# Altium schematic sheet Power.SchDoc: Power
size B; Organization: UCLA High Energy Physics; DocumentNumber: 7; Revision: 2.0; SheetNumber: 7; SheetTotal: 23; CurrentDate: 9/6/2018; ModifiedDate: 9/6/2018; Rule: PcbType=ProtelPcb
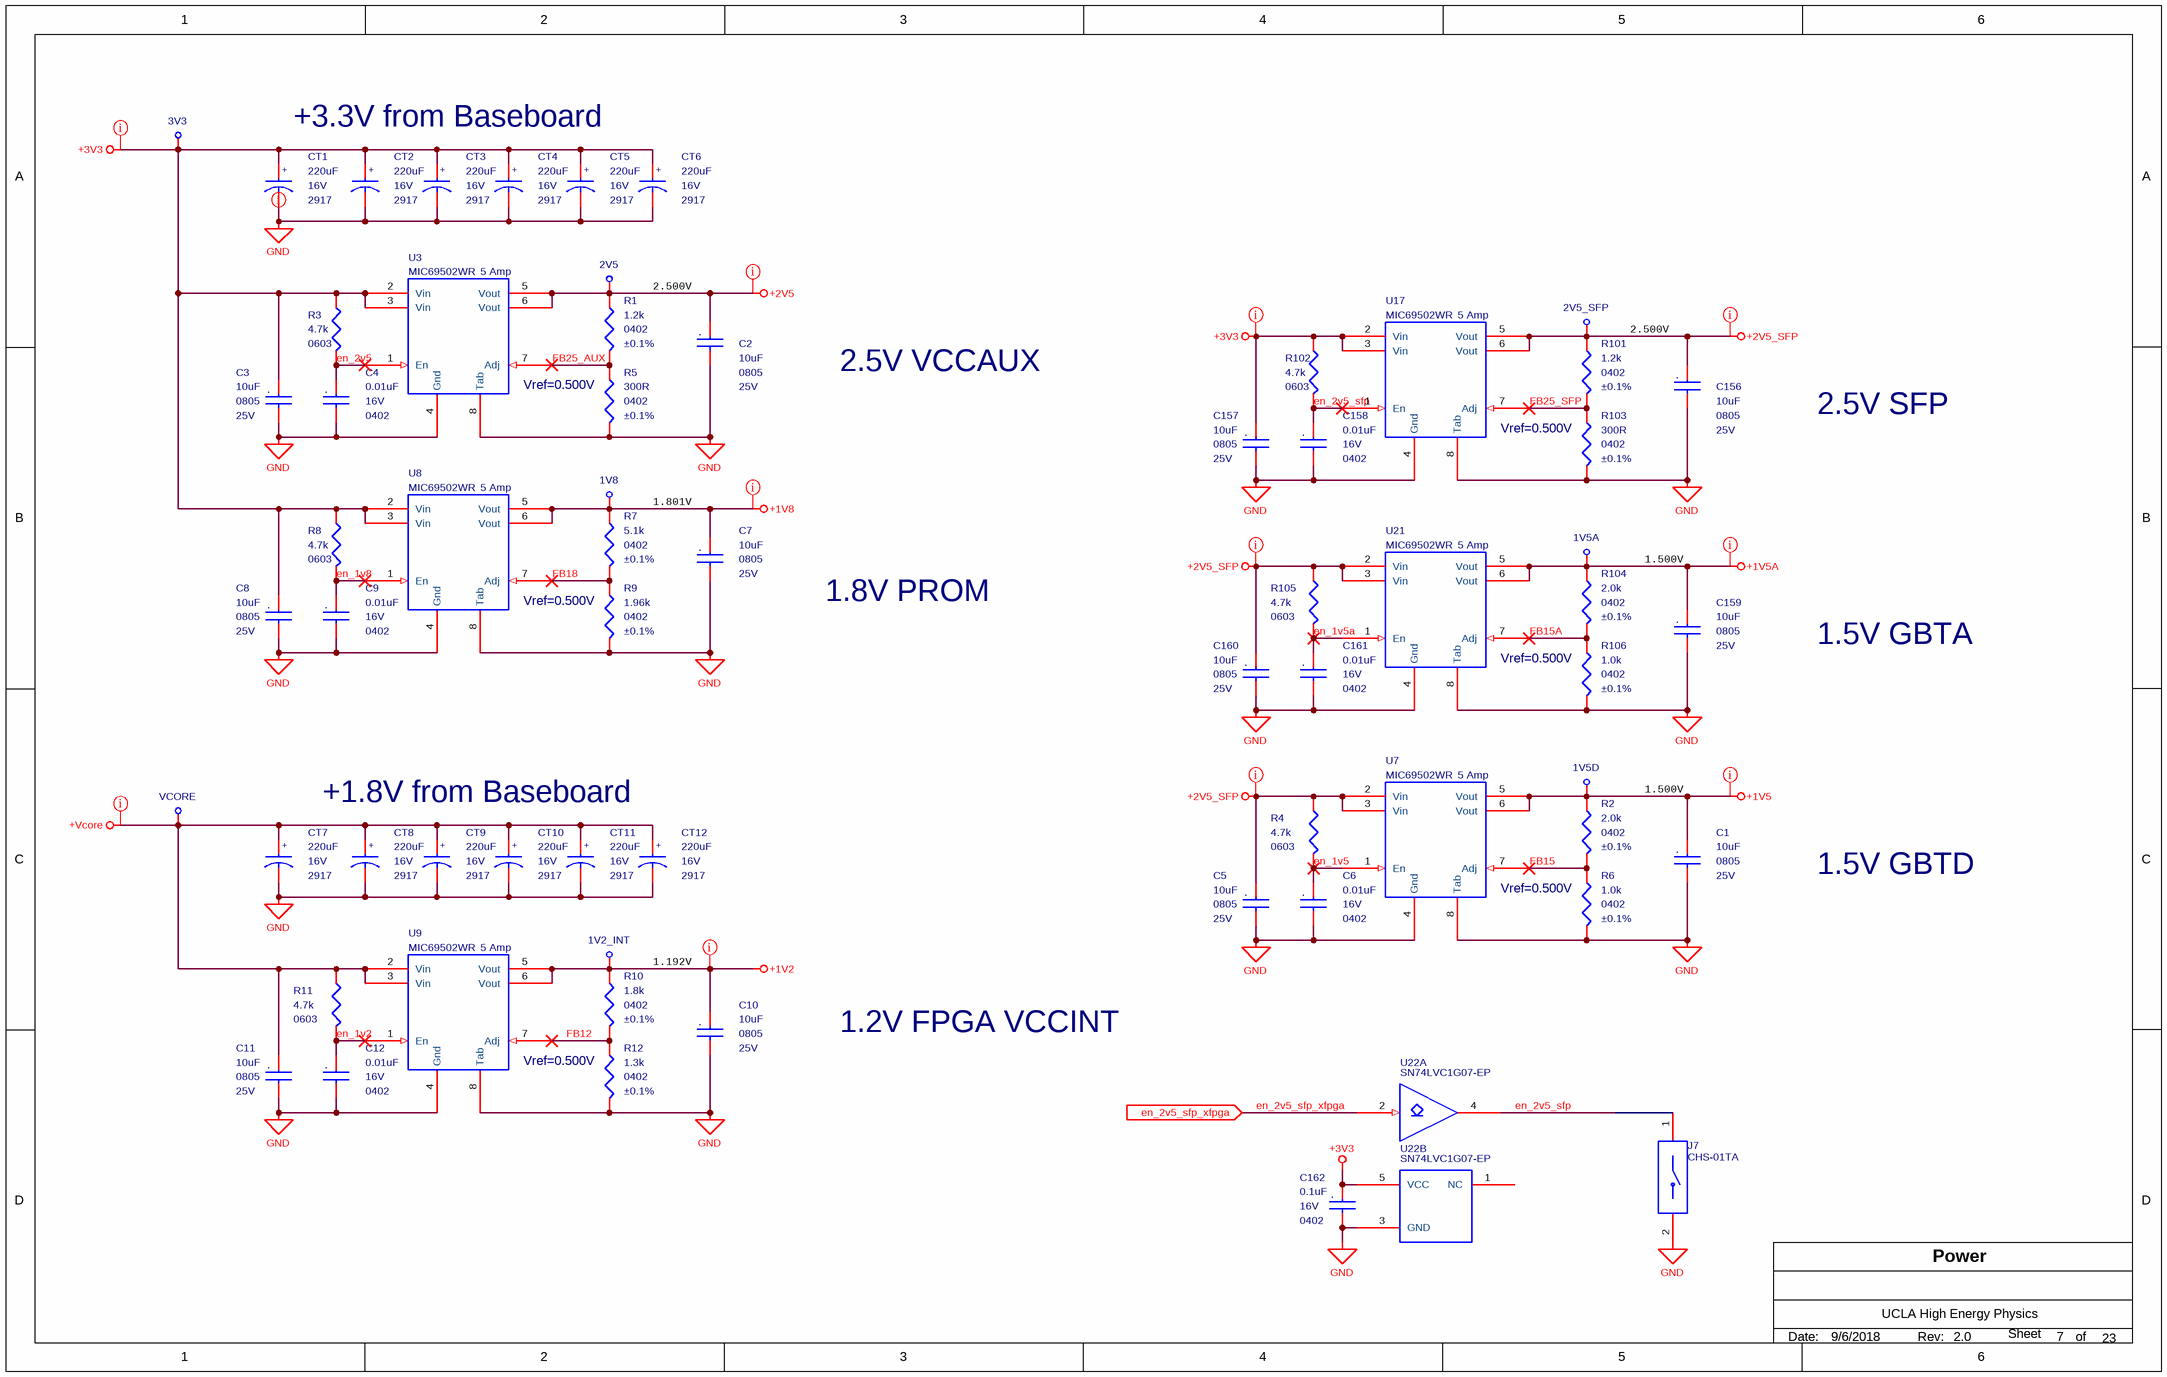
[diagram p0: Power.SchDoc]

## Parts
1V2_INT  Test Point Via  [MC_S6/TH/TPVIA]  (value not drawn)  (no BOM)
1V5A  Test Point Via  [MC_S6/TH/TPVIA]  (value not drawn)  (no BOM)
1V5D  Test Point Via  [MC_S6/TH/TPVIA]  (value not drawn)  (no BOM)
1V8  Test Point Via  [MC_S6/TH/TPVIA]  (value not drawn)  (no BOM)
2V5  Test Point Via  [MC_S6/TH/TPVIA]  (value not drawn)  (no BOM)
2V5_SFP  Test Point Via  [MC_S6/TH/TPVIA]  (value not drawn)  (no BOM)
3V3  Test Point Via  [MC_S6/TH/TPVIA]  (value not drawn)  (no BOM)
C1  10uF  Voltage - Rated: 25V  package: 0805  [MC_S6/SM/C_0805_IPC]
C2  10uF  Voltage - Rated: 25V  package: 0805  [MC_S6/SM/C_0805_IPC]
C3  10uF  Voltage - Rated: 25V  package: 0805  [MC_S6/SM/C_0805_IPC]
C4  0.01uF  Voltage - Rated: 16V  package: 0402  [MC_S6/SM/C_0402_IPC]
C5  10uF  Voltage - Rated: 25V  package: 0805  [MC_S6/SM/C_0805_IPC]
C6  0.01uF  Voltage - Rated: 16V  package: 0402  [MC_S6/SM/C_0402_IPC]
C7  10uF  Voltage - Rated: 25V  package: 0805  [MC_S6/SM/C_0805_IPC]
C8  10uF  Voltage - Rated: 25V  package: 0805  [MC_S6/SM/C_0805_IPC]
C9  0.01uF  Voltage - Rated: 16V  package: 0402  [MC_S6/SM/C_0402_IPC]
C10  10uF  Voltage - Rated: 25V  package: 0805  [MC_S6/SM/C_0805_IPC]
C11  10uF  Voltage - Rated: 25V  package: 0805  [MC_S6/SM/C_0805_IPC]
C12  0.01uF  Voltage - Rated: 16V  package: 0402  [MC_S6/SM/C_0402_IPC]
C156  10uF  Voltage - Rated: 25V  package: 0805  [MC_S6/SM/C_0805_IPC]
C157  10uF  Voltage - Rated: 25V  package: 0805  [MC_S6/SM/C_0805_IPC]
C158  0.01uF  Voltage - Rated: 16V  package: 0402  [MC_S6/SM/C_0402_IPC]
C159  10uF  Voltage - Rated: 25V  package: 0805  [MC_S6/SM/C_0805_IPC]
C160  10uF  Voltage - Rated: 25V  package: 0805  [MC_S6/SM/C_0805_IPC]
C161  0.01uF  Voltage - Rated: 16V  package: 0402  [MC_S6/SM/C_0402_IPC]
C162  0.1uF  package: 0402  Voltage - Rated: 16V  [MC_S6/SM/C_0402_IPC]
CT1  220uF  Voltage - Rated: 16V  package: 2917  [MC_S6/SM/CT_2917_D]
CT2  220uF  Voltage - Rated: 16V  package: 2917  [MC_S6/SM/CT_2917_D]
CT3  220uF  Voltage - Rated: 16V  package: 2917  [MC_S6/SM/CT_2917_D]
CT4  220uF  Voltage - Rated: 16V  package: 2917  [MC_S6/SM/CT_2917_D]
CT5  220uF  Voltage - Rated: 16V  package: 2917  [MC_S6/SM/CT_2917_D]
CT6  220uF  Voltage - Rated: 16V  package: 2917  [MC_S6/SM/CT_2917_D]
CT7  220uF  Voltage - Rated: 16V  package: 2917  [MC_S6/SM/CT_2917_D]
CT8  220uF  Voltage - Rated: 16V  package: 2917  [MC_S6/SM/CT_2917_D]
CT9  220uF  Voltage - Rated: 16V  package: 2917  [MC_S6/SM/CT_2917_D]
CT10  220uF  Voltage - Rated: 16V  package: 2917  [MC_S6/SM/CT_2917_D]
CT11  220uF  Voltage - Rated: 16V  package: 2917  [MC_S6/SM/CT_2917_D]
CT12  220uF  Voltage - Rated: 16V  package: 2917  [MC_S6/SM/CT_2917_D]
J7  CHS-01TA  [CHS-01TA]
R1  1.2k  Tolerance: ±0.1%  package: 0402  [MC_S6/SM/R_0402_IPC]
R2  2.0k  Tolerance: ±0.1%  package: 0402  [MC_S6/SM/R_0402_IPC]
R3  4.7k  Supplier Device Package: 0603  [MC_S6/SM/R_0603_IPC]
R4  4.7k  Supplier Device Package: 0603  [MC_S6/SM/R_0603_IPC]
R5  300R  Tolerance: ±0.1%  package: 0402  [MC_S6/SM/R_0402_IPC]
R6  1.0k  Tolerance: ±0.1%  package: 0402  [MC_S6/SM/R_0402_IPC]
R7  5.1k  Tolerance: ±0.1%  Supplier Device Package: 0402  [MC_S6/SM/R_0402_IPC]
R8  4.7k  Supplier Device Package: 0603  [MC_S6/SM/R_0603_IPC]
R9  1.96k  Tolerance: ±0.1%  package: 0402  [MC_S6/SM/R_0402_IPC]
R10  1.8k  Tolerance: ±0.1%  Supplier Device Package: 0402  [MC_S6/SM/R_0402_IPC]
R11  4.7k  Supplier Device Package: 0603  [MC_S6/SM/R_0603_IPC]
R12  1.3k  Tolerance: ±0.1%  Supplier Device Package: 0402  [MC_S6/SM/R_0402_IPC]
R101  1.2k  Tolerance: ±0.1%  package: 0402  [MC_S6/SM/R_0402_IPC]
R102  4.7k  Supplier Device Package: 0603  [MC_S6/SM/R_0603_IPC]
R103  300R  Tolerance: ±0.1%  package: 0402  [MC_S6/SM/R_0402_IPC]
R104  2.0k  Tolerance: ±0.1%  package: 0402  [MC_S6/SM/R_0402_IPC]
R105  4.7k  Supplier Device Package: 0603  [MC_S6/SM/R_0603_IPC]
R106  1.0k  Tolerance: ±0.1%  package: 0402  [MC_S6/SM/R_0402_IPC]
U3  MIC69502WR  [MC_S6/SM/SPAK7]
U7  MIC69502WR  [MC_S6/SM/SPAK7]
U8  MIC69502WR  [MC_S6/SM/SPAK7]
U9  MIC69502WR  [MC_S6/SM/SPAK7]
U17  MIC69502WR  [MC_S6/SM/SPAK7]
U21  MIC69502WR  [MC_S6/SM/SPAK7]
U22  SN74LVC1G07-EP  [SOT353-1]  (parts A,B of 2)
VCORE  Test Point Via  [MC_S6/TH/TPVIA]  (value not drawn)  (no BOM)

## Ports
en_2v5_sfp_xfpga (in)

## Nets
+1V2: 1V2_INT.1(In) C10.1 R10.1 U9.5(Vout) U9.6(Vout)
+1V5: 1V5D.1(In) C1.1 R2.1 U7.5(Vout) U7.6(Vout)
+1V5A: 1V5A.1(In) C159.1 R104.1 U21.5(Vout) U21.6(Vout)
+1V8: 1V8.1(In) C7.1 R7.1 U8.5(Vout) U8.6(Vout)
+2V5: 2V5.1(In) C2.1 R1.1 U3.5(Vout) U3.6(Vout)
+2V5_SFP: 2V5_SFP.1(In) C5.1 C156.1 C160.1 R4.1 R101.1 R105.1 U7.2(Vin) U7.3(Vin) U17.5(Vout) U17.6(Vout) U21.2(Vin) U21.3(Vin)
+3V3: 3V3.1(In) C3.1 C8.1 C157.1 C162.1 CT1.1 CT2.1 CT3.1 CT4.1 CT5.1 CT6.1 R3.1 R8.1 R102.1 U3.2(Vin) U3.3(Vin) U8.2(Vin) U8.3(Vin) U17.2(Vin) U17.3(Vin) U22.5(VCC)
+Vcore: C11.1 CT7.1 CT8.1 CT9.1 CT10.1 CT11.1 CT12.1 R11.1 U9.2(Vin) U9.3(Vin) VCORE.1(In)
GND: C1.2 C2.2 C3.2 C4.2 C5.2 C6.2 C7.2 C8.2 C9.2 C10.2 C11.2 C12.2 C156.2 C157.2 C158.2 C159.2 C160.2 C161.2 C162.2 CT1.2 CT2.2 CT3.2 CT4.2 CT5.2 CT6.2 CT7.2 CT8.2 CT9.2 CT10.2 CT11.2 CT12.2 J7.2 R5.2 R6.2 R9.2 R12.2 R103.2 R106.2 U3.4(Gnd) U3.8(Tab) U7.4(Gnd) U7.8(Tab) U8.4(Gnd) U8.8(Tab) U9.4(Gnd) U9.8(Tab) U17.4(Gnd) U17.8(Tab) U21.4(Gnd) U21.8(Tab) U22.3(GND)
en_1v2: C12.1 R11.2 U9.1(En)
en_1v5: C6.1 R4.2 U7.1(En)
en_1v5a: C161.1 R105.2 U21.1(En)
en_1v8: C9.1 R8.2 U8.1(En)
en_2v5: C4.1 R3.2 U3.1(En)
en_2v5_sfp: C158.1 J7.1 R102.2 U17.1(En) U22.4(Y)
en_2v5_sfp_xfpga: U22.2(A) ; port en_2v5_sfp_xfpga
FB12: R10.2 R12.1 U9.7(Adj)
FB15: R2.2 R6.1 U7.7(Adj)
FB15A: R104.2 R106.1 U21.7(Adj)
FB18: R7.2 R9.1 U8.7(Adj)
FB25_AUX: R1.2 R5.1 U3.7(Adj)
FB25_SFP: R101.2 R103.1 U17.7(Adj)

Not connected (* = marked no-connect by the designer): U22 1(NC)

## Layout directives
net class Power: +1V2, +1V5, +1V5A, +1V8, +2V5, +2V5_SFP, +3V3, +Vcore, GND

## Notes on the sheet
- +3.3V from Baseboard
- (near U3) 5 Amp
- 2.500V
- (near U17) 5 Amp
- Vref=0.500V
- 2.5V VCCAUX
- 2.5V SFP
- (near U8) 5 Amp
- 1.801V
- 1.8V PROM
- (near U21) 5 Amp
- 1.500V
- 1.5V GBTA
- +1.8V from Baseboard
- (near U7) 5 Amp
- 1.5V GBTD
- (near U9) 5 Amp
- 1.192V
- 1.2V FPGA VCCINT
- Date:
- Rev:
- of
- Sheet
- (in symbol C0402C103K4RACTU) .
- (in symbol C0402C104K4RACTU) .
- (in symbol GRM21BR61E106KA73L) .
- (in symbol T491D227K016AT) +

## Library data of the parts
1V2_INT 1V5A 1V5D 1V8 2V5 2V5_SFP 3V3 VCORE = TPVIA: COMPSIDE: TOP; COMPGROUP: 0; mfgr: Layout; COMPROT: 0; Package: 90; mfgr_id: TPVIA; mfgr_foot: TPVIA
C1-C3 C5 C7 C8 C10 C11 C156 C157 C159 C160 = GRM21BR61E106KA73L: CAP CER 10UF 25V X5R 0805; Manufacturer: Murata Electronics North America; Capacitance: 10µF; Tolerance: ±10%; Supplier 1: Digi-Key; Manufacturer Part Number: GRM21BR61E106KA73L; RoHS: RoHS Compliant; Category: Capacitors; Stock 1: 607428; Pricing 1: 1=0.19, 10=0.13, 50=0.0748, 100=0.0618, 250=0.052, 500=0.04356, 1000=0.03575 (USD); Packaging: Cut Tape (CT); Part Status: Active; Temperature Coefficient: X5R; Operating Temperature: -55°C ~ 85°C; Features: -; Ratings: -; Applications: General Purpose; Mounting Type: Surface Mount, MLCC; Package / Case: 0805 (2012 Metric); Size / Dimension: 0.079" L x 0.049" W (2.00mm x 1.25mm); Height - Seated (Max): -; Thickness (Max): 0.053" (1.35mm); Lead Spacing: -; Lead Style: -; ComponentLink1URL: http://www.murata.com/~/media/webrenewal/support/library/catalog/products/capacitor/mlcc/c02e.pdf; ComponentLink1Description: http://www.murata.com/~/media/webrenewal/support/library/catalog/products/capacitor/mlcc/c02e.pdf; Supplier 2: Digi-Key; Supplier Part Number 1: 490-5523-1-ND; Supplier Part Number 2: 490-5523-6-ND
C4 C6 C9 C12 C158 C161 = C0402C103K4RACTU: CAP CER 10nF 16V X7R 0402; Manufacturer: KEMET; Capacitance: 10000pF; Tolerance: ±10%; Supplier 1: Digi-Key; Manufacturer Part Number: C0402C103K4RACTU; RoHS: RoHS Compliant; Category: Capacitors; Stock 1: 605739; Pricing 1: 1=0.1, 10=0.02, 25=0.0144, 50=0.0108, 100=0.0088, 250=0.00732, 500=0.00626, 1000=0.00492, 5000=0.00412 (USD); Packaging: Cut Tape (CT); Part Status: Active; Temperature Coefficient: X7R; Operating Temperature: -55°C ~ 125°C; Features: -; Ratings: -; Applications: General Purpose; Failure Rate: -; Mounting Type: Surface Mount, MLCC; Package / Case: 0402 (1005 Metric); Size / Dimension: 0.039" L x 0.020" W (1.00mm x 0.50mm); Height - Seated (Max): -; Thickness (Max): 0.022" (0.55mm); Lead Spacing: -; Lead Style: -; ComponentLink1URL: http://www.kemet.com/docfinder?Partnumber=C0402C103K4RACTU; ComponentLink1Description: http://www.kemet.com/docfinder?Partnumber=C0402C103K4RACTU; Supplier 2: Digi-Key; Stock 2: 605739; Pricing 2: 1=0.1, 10=0.02, 25=0.0144, 50=0.0108, 100=0.0088, 250=0.00732, 500=0.00626, 1000=0.00492, 5000=0.00412 (USD); Supplier Part Number 1: 399-1038-1-ND; Supplier Part Number 2: 399-1038-6-ND
C162 = C0402C104K4RACTU: CAP CER 0.1UF 16V X7R 0402; Manufacturer: KEMET; Capacitance: 0.10µF; Tolerance: ±10%; Supplier 1: Digi-Key; Manufacturer Part Number: C0402C104K4RACTU; RoHS: RoHS Compliant; Category: Capacitors; Stock 1: 3565698; Pricing 1: 1=0.11, 10=0.078, 25=0.0568, 50=0.0442, 100=0.0365, 250=0.03024, 500=0.02562, 1000=0.02121, 5000=0.01806 (USD); Packaging: Cut Tape (CT); Part Status: Active; Operating Temperature: -55°C ~ 125°C; Features: -; Ratings: -; Applications: General Purpose; Failure Rate: -; Mounting Type: Surface Mount, MLCC; Package / Case: 0402 (1005 Metric); Size / Dimension: 0.039" L x 0.020" W (1.00mm x 0.50mm); Height - Seated (Max): -; Thickness (Max): 0.022" (0.55mm); Lead Spacing: -; Lead Style: -; ComponentLink1URL: http://www.kemet.com/docfinder?Partnumber=C0402C104K4RACTU; ComponentLink1Description: http://www.kemet.com/docfinder?Partnumber=C0402C104K4RACTU; Supplier 2: Digi-Key; Stock 2: 3565998; Pricing 2: 1=0.11, 10=0.078, 25=0.0568, 50=0.0442, 100=0.0365, 250=0.03024, 500=0.02562, 1000=0.02121, 5000=0.01806 (USD); Supplier Part Number 1: 399-3521-1-ND; Supplier Part Number 2: 399-3521-6-ND; Temperature Coefficient: X7R
CT1-CT12 = T491D227K016AT: CAP TANT 220UF 16V 10% 2917; Manufacturer: KEMET; Manufacturer Size Code: D; Capacitance: 220µF; ESR (Equivalent Series Resistance): 500 mOhm; Lifetime @ Temp.: 2000 Hrs @ 85°C; Supplier 1: Digi-Key; Manufacturer Part Number: T491D227K016AT; RoHS: RoHS Compliant; Category: Capacitors; Stock 1: 48724; Pricing 1: 1=1.28, 10=1.009, 25=0.9248, 50=0.8744, 100=0.7568, 250=0.67268 (USD); Packaging: Cut Tape (CT); Part Status: Active; Tolerance: ±10%; Type: Molded; Operating Temperature: -55°C ~ 125°C; Mounting Type: Surface Mount; Package / Case: 2917 (7343 Metric); Size / Dimension: 0.287" L x 0.169" W (7.30mm x 4.30mm); Height - Seated (Max): 0.122" (3.10mm); Lead Spacing: -; Features: General Purpose; Failure Rate: -; ComponentLink1URL: http://www.kemet.com/Lists/ProductCatalog/Attachments/254/KEM_T2005_T491.pdf; ComponentLink1Description: http://www.kemet.com/Lists/ProductCatalog/Attachments/254/KEM_T2005_T491.pdf; Supplier 2: Digi-Key; Stock 2: 48724; Pricing 2: 1=1.28, 10=1.009, 25=0.9248, 50=0.8744, 100=0.7568, 250=0.67268 (USD); Supplier Part Number 1: 399-10429-1-ND; Supplier Part Number 2: 399-10429-6-ND
J7 = CHS-01TA: SWITCH SLIDE DIP SPST 100MA 6V; Manufacturer: Nidec Copal; Body Material: Polyphenylene; Number of Positions: 1; Electrical Life: 2000Cycles; Max Voltage Rating (DC): 24V; Pitch: 0.05inch; Washable: Yes; ComponentLink1URL: https://www.ctscorp.com/wp-content/uploads/219.pdf; ComponentLink1Description: https://www.ctscorp.com/wp-content/uploads/219.pdf; Supplier 1: Digi-Key; Manufacturer Part Number: CHS-01TA; Stock 1: 148558; Pricing 1: 1=0.98, 10=0.961, 25=0.9056, 50=0.85, 100=0.8131, 250=0.77616, 500=0.70224 (USD); Mount: Surface Mount; Contact Material: Copper Alloy; Contact Plating: Gold; Min Operating Temperature: -40°C; Max Operating Temperature: 85°C; Packaging: Tape and Reel; Throw Configuration: SPST; Voltage Rating (DC): 6V; Current Rating: 100mA; Termination: J-Hook; Orientation: Vertical; Length: 0.098inch; Lead Free: Lead Free; ComponentLink2URL: https://datasheet.ciiva.com/2863/chs-2863448.pdf; ComponentLink2Description: https://datasheet.ciiva.com/2863/chs-2863448.pdf; ComponentLink3URL: https://datasheet.ciiva.com/2863/chs-2863449.pdf; ComponentLink3Description: https://datasheet.ciiva.com/2863/chs-2863449.pdf; ComponentLink4URL: https://datasheet.ciiva.com/2863/chs-2863450.pdf; ComponentLink4Description: https://datasheet.ciiva.com/2863/chs-2863450.pdf; Supplier Part Number 1: 563-1003-1-ND
R1 R101 = ERA-2AEB122X: RES SMD 1.2K OHM 0.1% 1/16W 0402; Manufacturer: Panasonic Electronic Components; Power (Watts): 0.063W, 1/16W; Temperature Coefficient: ±25ppm/°C; Supplier 1: Digi-Key; Manufacturer Part Number: ERA-2AEB122X; RoHS: RoHS Compliant; Category: Resistors; Stock 1: 25790; Pricing 1: 1=0.45, 10=0.321, 100=0.1283, 1000=0.06322, 2500=0.05858, 5000=0.053 (USD); Packaging: Cut Tape (CT); Part Status: Active; Composition: Thin Film; Features: Automotive AEC-Q200; Operating Temperature: -55°C ~ 155°C; Package / Case: 0402 (1005 Metric); Size / Dimension: 0.039" L x 0.020" W (1.00mm x 0.50mm); Height - Seated (Max): 0.016" (0.40mm); Failure Rate: -; ComponentLink1URL: https://industrial.panasonic.com/cdbs/www-data/pdf/RDM0000/AOA0000C307.pdf; ComponentLink1Description: https://industrial.panasonic.com/cdbs/www-data/pdf/RDM0000/AOA0000C307.pdf; Supplier 2: Digi-Key; Stock 2: 25790; Pricing 2: 1=0.45, 10=0.321, 100=0.1283, 1000=0.06322, 2500=0.05858, 5000=0.053 (USD); Supplier Part Number 1: P1.2KDCCT-ND; Supplier Part Number 2: P1.2KDCDKR-ND; Supplier Device Package: 0402
R2 R104 = ERA-2AEB202X: RES SMD 2.0K OHM 0.1% 1/16W 0402; Manufacturer: Panasonic Electronic Components; Power (Watts): 0.063W, 1/16W; Temperature Coefficient: ±25ppm/°C; Supplier 1: Digi-Key; Manufacturer Part Number: ERA-2AEB202X; RoHS: RoHS Compliant; Category: Resistors; Stock 1: 204508; Pricing 1: 1=0.45, 10=0.321, 100=0.1283, 1000=0.06322, 2500=0.05858, 5000=0.053 (USD); Packaging: Digi-Reel®; Part Status: Active; Composition: Thin Film; Features: Automotive AEC-Q200; Operating Temperature: -55°C ~ 155°C; Package / Case: 0402 (1005 Metric); Size / Dimension: 0.039" L x 0.020" W (1.00mm x 0.50mm); Height - Seated (Max): 0.016" (0.40mm); Failure Rate: -; ComponentLink1URL: https://industrial.panasonic.com/cdbs/www-data/pdf/RDM0000/AOA0000C307.pdf; ComponentLink1Description: https://industrial.panasonic.com/cdbs/www-data/pdf/RDM0000/AOA0000C307.pdf; Supplier 2: Digi-Key; Stock 2: 204508; Pricing 2: 1=0.45, 10=0.321, 100=0.1283, 1000=0.06322, 2500=0.05858, 5000=0.053 (USD); Supplier Part Number 1: P2.0KDCDKR-ND; Supplier Part Number 2: P2.0KDCCT-ND; Supplier Device Package: 0402
R3 R4 R8 R11 R102 R105 = CR0603-FX-4701ELF: RES SMD 4.7K OHM 1% 1/10W 0603; Manufacturer: Bourns Inc.; Power (Watts): 0.1W, 1/10W; Temperature Coefficient: ±100ppm/°C; Tolerance: ±1%; Supplier 1: Digi-Key; Manufacturer Part Number: CR0603-FX-4701ELF; RoHS: RoHS Compliant; Category: Resistors; Stock 1: 43560; Pricing 1: 1=0.1, 10=0.021, 100=0.0086, 1000=0.00385, 2500=0.00334 (USD); Packaging: Cut Tape (CT); Part Status: Active; Resistance (Ohms): 4.7k; Composition: Thick Film; Features: Moisture Resistant; Operating Temperature: -55°C ~ 155°C; Package / Case: 0603 (1608 Metric); Size / Dimension: 0.063" L x 0.031" W (1.60mm x 0.80mm); Height - Seated (Max): 0.022" (0.55mm); Failure Rate: -; ComponentLink1URL: http://www.bourns.com/docs/Product-Datasheets/CHPREZTR.pdf; ComponentLink1Description: http://www.bourns.com/docs/Product-Datasheets/CHPREZTR.pdf; Supplier 2: Digi-Key; Stock 2: 43560; Pricing 2: 1=0.1, 10=0.021, 100=0.0086, 1000=0.00385, 2500=0.00334 (USD); Supplier Part Number 1: CR0603-FX-4701ELFCT-ND; Supplier Part Number 2: CR0603-FX-4701ELFDKR-ND
R5 R103 = ERA-2AEB301X: RES SMD 300 OHM 0.1% 1/16W 0402; Manufacturer: Panasonic Electronic Components; Power (Watts): 0.063W, 1/16W; Temperature Coefficient: ±25ppm/°C; Supplier 1: Digi-Key; Manufacturer Part Number: ERA-2AEB301X; RoHS: RoHS Compliant; Category: Resistors; Stock 1: 31760; Pricing 1: 1=0.45, 10=0.321, 100=0.1283, 1000=0.06322, 2500=0.05858, 5000=0.053 (USD); Packaging: Cut Tape (CT); Part Status: Active; Composition: Thin Film; Features: Automotive AEC-Q200; Operating Temperature: -55°C ~ 155°C; Package / Case: 0402 (1005 Metric); Supplier Device Package: 0402; Size / Dimension: 0.039" L x 0.020" W (1.00mm x 0.50mm); Height - Seated (Max): 0.016" (0.40mm); Failure Rate: -; ComponentLink1URL: https://industrial.panasonic.com/cdbs/www-data/pdf/RDM0000/AOA0000C307.pdf; ComponentLink1Description: https://industrial.panasonic.com/cdbs/www-data/pdf/RDM0000/AOA0000C307.pdf; Supplier 2: Digi-Key; Stock 2: 31760; Pricing 2: 1=0.45, 10=0.321, 100=0.1283, 1000=0.06322, 2500=0.05858, 5000=0.053 (USD); Supplier Part Number 1: P300DCCT-ND; Supplier Part Number 2: P300DCDKR-ND
R6 R106 = ERA-2AEB102X: RES SMD 1.0K OHM 0.1% 1/16W 0402; Manufacturer: Panasonic Electronic Components; Power (Watts): 0.063W, 1/16W; Temperature Coefficient: ±25ppm/°C; Supplier 1: Digi-Key; Manufacturer Part Number: ERA-2AEB102X; RoHS: RoHS Compliant; Category: Resistors; Stock 1: 473705; Pricing 1: 1=0.45, 10=0.321, 100=0.1283, 1000=0.06322, 2500=0.05858, 5000=0.053 (USD); Packaging: Cut Tape (CT); Part Status: Active; Composition: Thin Film; Features: Automotive AEC-Q200; Operating Temperature: -55°C ~ 155°C; Package / Case: 0402 (1005 Metric); Size / Dimension: 0.039" L x 0.020" W (1.00mm x 0.50mm); Height - Seated (Max): 0.016" (0.40mm); Failure Rate: -; ComponentLink1URL: https://industrial.panasonic.com/cdbs/www-data/pdf/RDM0000/AOA0000C307.pdf; ComponentLink1Description: https://industrial.panasonic.com/cdbs/www-data/pdf/RDM0000/AOA0000C307.pdf; Supplier 2: Digi-Key; Stock 2: 473705; Pricing 2: 1=0.45, 10=0.321, 100=0.1283, 1000=0.06322, 2500=0.05858, 5000=0.053 (USD); Supplier Part Number 1: P1.0KDCCT-ND; Supplier Part Number 2: P1.0KDCDKR-ND; Supplier Device Package: 0402
R7 = ERA-2AEB512X: RES SMD 5.1K OHM 0.1% 1/16W 0402; Manufacturer: Panasonic Electronic Components; Power (Watts): 0.063W, 1/16W; Temperature Coefficient: ±25ppm/°C; Supplier 1: Digi-Key; Manufacturer Part Number: ERA-2AEB512X; RoHS: RoHS Compliant; Category: Resistors; Stock 1: 26098; Pricing 1: 1=0.61, 50=0.238, 100=0.1913, 250=0.14876, 500=0.1122, 1000=0.0867, 5000=0.0646 (USD); Packaging: Cut Tape (CT); Part Status: Active; Resistance (Ohms): 5.1k; Composition: Thin Film; Features: Automotive AEC-Q200; Operating Temperature: -55°C ~ 155°C; Package / Case: 0402 (1005 Metric); Size / Dimension: 0.039" L x 0.020" W (1.00mm x 0.50mm); Height - Seated (Max): 0.016" (0.40mm); Failure Rate: -; ComponentLink1URL: https://industrial.panasonic.com/cdbs/www-data/pdf/RDA0000/AOA0000C237.pdf; ComponentLink1Description: https://industrial.panasonic.com/cdbs/www-data/pdf/RDA0000/AOA0000C237.pdf; Supplier 2: Digi-Key; Stock 2: 26098; Pricing 2: 1=0.61, 50=0.238, 100=0.1913, 250=0.14876, 500=0.1122, 1000=0.0867, 5000=0.0646 (USD); Supplier Part Number 1: P5.1KDCCT-ND; Supplier Part Number 2: P5.1KDCDKR-ND; Number of Terminations: 2
R9 = ERA-2AEB1961X: RES SMD 1.96K OHM 0.1% 1/16W 0402; Manufacturer: Panasonic Electronic Components; Power (Watts): 0.063W, 1/16W; Temperature Coefficient: ±25ppm/°C; Supplier 1: Digi-Key; Manufacturer Part Number: ERA-2AEB1961X; RoHS: RoHS Compliant; Category: Resistors; Stock 1: 36796; Pricing 1: 1=0.45, 10=0.321, 100=0.1283, 1000=0.06322, 2500=0.05858, 5000=0.053 (USD); Packaging: Cut Tape (CT); Part Status: Active; Composition: Thin Film; Features: Automotive AEC-Q200; Operating Temperature: -55°C ~ 155°C; Package / Case: 0402 (1005 Metric); Size / Dimension: 0.039" L x 0.020" W (1.00mm x 0.50mm); Height - Seated (Max): 0.016" (0.40mm); Failure Rate: -; ComponentLink1URL: https://industrial.panasonic.com/cdbs/www-data/pdf/RDM0000/AOA0000C307.pdf; ComponentLink1Description: https://industrial.panasonic.com/cdbs/www-data/pdf/RDM0000/AOA0000C307.pdf; Supplier 2: Digi-Key; Stock 2: 36796; Pricing 2: 1=0.45, 10=0.321, 100=0.1283, 1000=0.06322, 2500=0.05858, 5000=0.053 (USD); Supplier Part Number 1: P1.96KDCCT-ND; Supplier Part Number 2: P1.96KDCDKR-ND; Supplier Device Package: 0402
R10 = ERA-2AEB182X: RES SMD 1.8k OHM 0.1% 1/16W 0402; Manufacturer: Panasonic Electronic Components; Power (Watts): 0.063W, 1/16W; Temperature Coefficient: ±25ppm/°C; Supplier 1: Digi-Key; Manufacturer Part Number: ERA-2AEB182X; RoHS: RoHS Compliant; Category: Resistors; Stock 1: 39375; Pricing 1: 1=0.6, 50=0.2484, 100=0.2052, 250=0.162, 500=0.13824, 1000=0.10368, 5000=0.07776 (USD); Packaging: Cut Tape (CT); Part Status: Active; Resistance (Ohms): 1.8k; Composition: Thin Film; Features: Automotive AEC-Q200; Operating Temperature: -55°C ~ 155°C; Package / Case: 0402 (1005 Metric); Size / Dimension: 0.039" L x 0.020" W (1.00mm x 0.50mm); Height - Seated (Max): 0.016" (0.40mm); Failure Rate: -; ComponentLink1URL: https://industrial.panasonic.com/cdbs/www-data/pdf/RDA0000/AOA0000C237.pdf; ComponentLink1Description: https://industrial.panasonic.com/cdbs/www-data/pdf/RDA0000/AOA0000C237.pdf; Supplier 2: Digi-Key; Stock 2: 39375; Pricing 2: 1=0.6, 50=0.2484, 100=0.2052, 250=0.162, 500=0.13824, 1000=0.10368, 5000=0.07776 (USD); Supplier Part Number 1: P1.8KDCCT-ND; Supplier Part Number 2: P1.8KDCDKR-ND; Number of Terminations: 2
R12 = ERA-2AEB132X: RES SMD 1.3k OHM 0.1% 1/16W 0402; Manufacturer: Panasonic Electronic Components; Power (Watts): 0.063W, 1/16W; Temperature Coefficient: ±25ppm/°C; Supplier 1: Digi-Key; Manufacturer Part Number: ERA-2AEB132X; RoHS: RoHS Compliant; Category: Resistors; Stock 1: 249; Pricing 1: 1=0.45, 10=0.321, 100=0.1283, 1000=0.06322, 2500=0.05858, 5000=0.053 (USD); Packaging: Cut Tape (CT); Part Status: Active; Composition: Thin Film; Features: Automotive AEC-Q200; Operating Temperature: -55°C ~ 155°C; Package / Case: 0402 (1005 Metric); Size / Dimension: 0.039" L x 0.020" W (1.00mm x 0.50mm); Height - Seated (Max): 0.016" (0.40mm); Failure Rate: -; ComponentLink1URL: https://industrial.panasonic.com/cdbs/www-data/pdf/RDM0000/AOA0000C307.pdf; ComponentLink1Description: https://industrial.panasonic.com/cdbs/www-data/pdf/RDM0000/AOA0000C307.pdf; Supplier 2: Digi-Key; Stock 2: 249; Pricing 2: 1=0.45, 10=0.321, 100=0.1283, 1000=0.06322, 2500=0.05858, 5000=0.053 (USD); Supplier Part Number 1: P1.3KDCCT-ND; Supplier Part Number 2: P1.3KDCDKR-ND
U3 U7-U9 U17 U21 = MIC69502WR: IC REG LDO ADJ 5A SPAK-7; Manufacturer: Microchip Technology; Control Features: Enable; Output Configuration: Positive; Output Type: Adjustable; Protection Features: Over Current, Over Temperature; Voltage - Input (Max): 5.5V; Voltage - Output (Min/Fixed): 0.5V; Voltage Dropout (Max): 0.5V @ 5A; Category: Integrated Circuits (ICs); ComponentLink1Description: http://www.microchip.com/mymicrochip/filehandler.aspx?ddocname=en580586; ComponentLink1URL: http://www.microchip.com/mymicrochip/filehandler.aspx?ddocname=en580586; Current - Output: 5A; Manufacturer Part Number: MIC69502WR; Mounting Type: Surface Mount; Operating Temperature: -40°C ~ 125°C; Package / Case: SPak-7 (7 leads + Tab); Packaging: Tube; Part Status: Active; Pricing 1: 1=2.98, 25=2.4884, 100=2.2575 (USD); PSRR: -; RoHS: RoHS Compliant; Stock 1: 2547; Supplier 1: Digi-Key; Supplier Device Package: S-PAK-7; Supplier Part Number 1: 576-1613-ND; Voltage - Output (Max): 5.5V
U22 = SN74LVC1G07-EP: IC BUFF/DVR NON-INVERT Open Drain SC70-5; Manufacturer: Texas Instruments; mfgr_id: SN74LVC1G07MDCKREP; mfgr: Texas Inst; mfgr_foot: DCK; COMPROT: 270; COMPGROUP: 0; COMPSIDE: TOP; Logic Type: Buffer, Non-Inverting; Number of Bits per Element: 1; Current - Output High, Low: -, 32mA; Voltage - Supply: 1.65 V ~ 5.5 V; Package: 99; Supplier 1: Digi-Key; Manufacturer Part Number: SN74LVC1G07MDCKREP; RoHS: RoHS Compliant; Category: Integrated Circuits (ICs); Stock 1: 4252; Pricing 1: 1=0.81, 10=0.714, 100=0.5472, 500=0.4326, 1000=0.34608 (USD); Packaging: Cut Tape (CT); Part Status: Active; Input Type: -; Output Type: Open Drain; Operating Temperature: -55°C ~ 125°C (TA); Mounting Type: Surface Mount; Package / Case: 5-TSSOP, SC-70-5, SOT-353; Supplier Device Package: SC-70-5; ComponentLink1URL: http://www.ti.com/lit/ds/symlink/sn74lvc1g07-ep.pdf; ComponentLink1Description: http://www.ti.com/lit/ds/symlink/sn74lvc1g07-ep.pdf; Supplier 2: Digi-Key; Stock 2: 4252; Pricing 2: 1=0.81, 10=0.714, 100=0.5472, 500=0.4326, 1000=0.34608 (USD); Supplier Part Number 1: 296-22343-1-ND; Supplier Part Number 2: 296-22343-6-ND